# Altium schematic sheet 28Pins_Schematic.SchDoc (part 2 of 3)
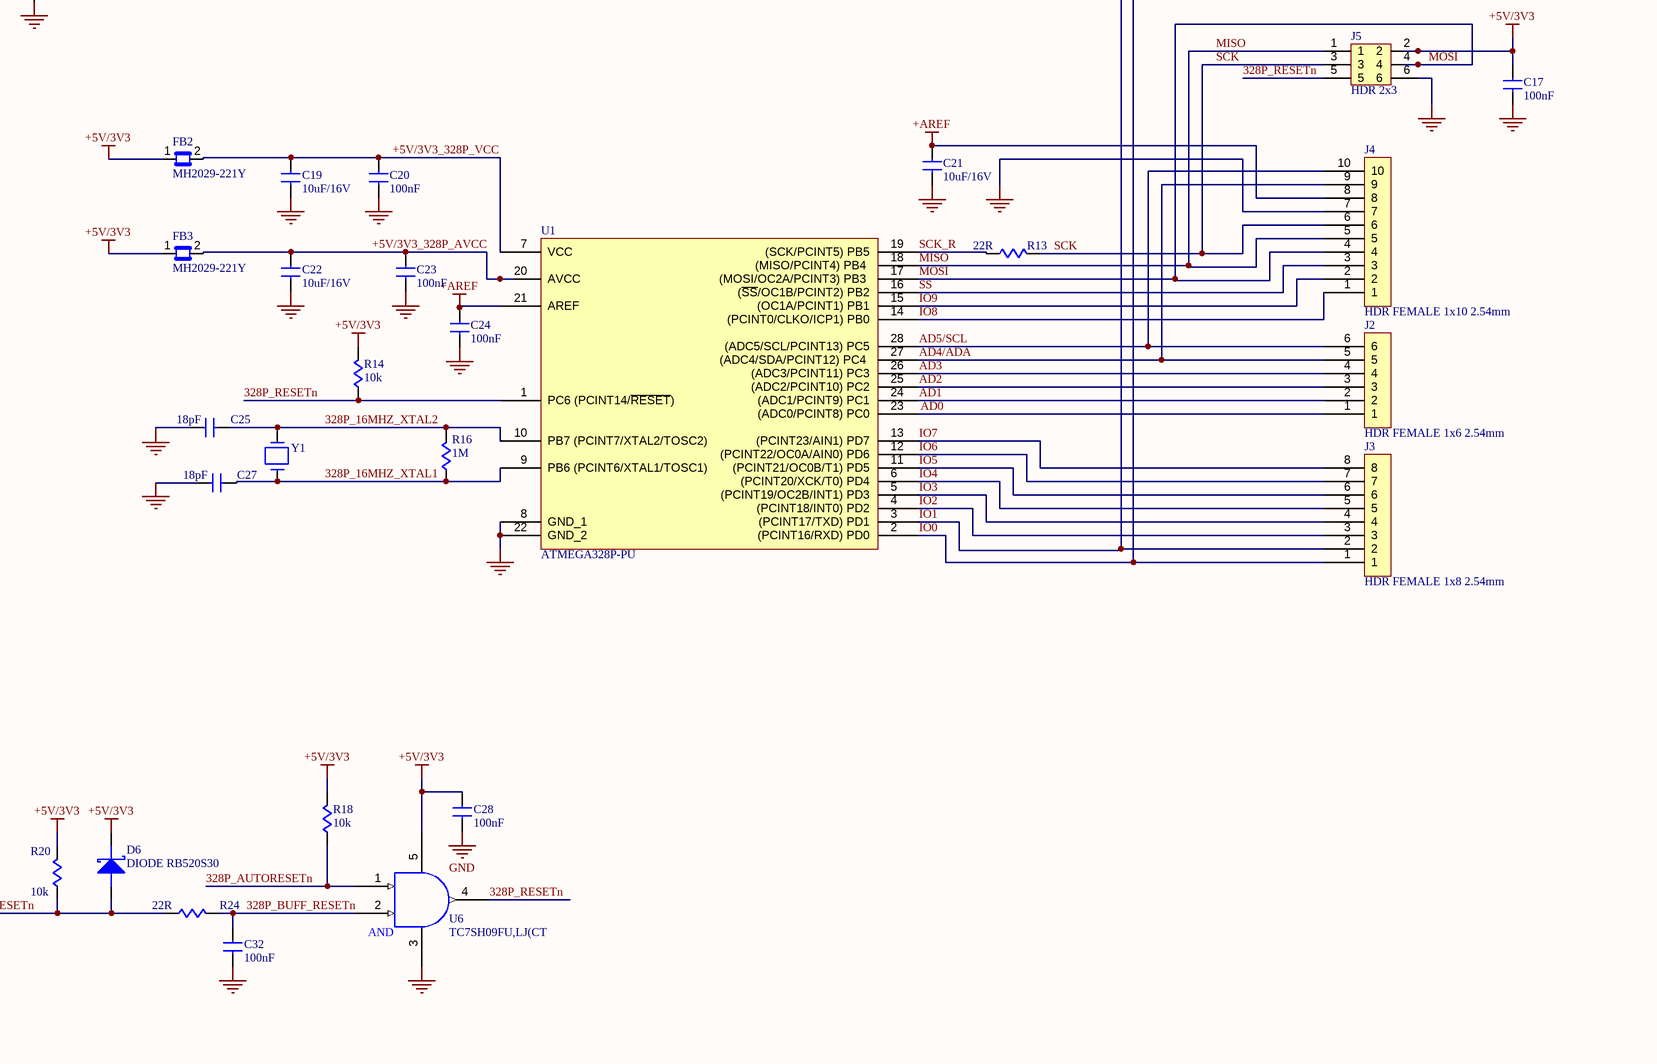
[diagram p4: 28Pins_Schematic.SchDoc, bottom right]
## Library data of the parts
C1 C2 = EEE-1AA101WAR: CAP ALUM 100UF 20% 10V SMD; Manufacturer: Panasonic; Ripple Current: 50mA; Polarity: Polar; Life (Hours): 1000Hour; Leakage Current: 3uA; Dissipation Factor: 0.3%; Supplier 1: Digi-Key; Supplier Part Number 1: PCE4566CT-ND; Manufacturer Part Number: EEE-1AA101WAR; RoHS: Yes; Category: Aluminum Electrolytic Capacitors; Stock 1: 1732; Pricing 1: 1=0.40000, 10=0.27900, 50=0.19520, 100=0.16730, 500=0.12550 (USD); Mount: Surface Mount,PCB; Case/Package: Radial; Min Operating Temperature: -40°C; Max Operating Temperature: 85°C; Capacitance: 100uF; Tolerance: 20%; Voltage Rating: 10V; Packaging: Tape and Reel; Package Quantity: 1000; Voltage Rating (DC): 10V; Ripple Current (AC): 50mA; Termination: SMD/SMT; Voltage: 10V; Series: Automotive, AEC-Q200, S; Construction: Cylindrical; Diameter: 5mm; Length: 5.5mm; Height: 5.4mm; Height - Seated (Max): 0.213inch; Lead Pitch: 1.5mm; Radiation Hardening: No; REACH SVHC: No SVHC; RoHS Compliant: Yes; ComponentLink1URL: https://datasheet.ciiva.com/2985/aba0000ce115-2985041.pdf?src-supplier=Avnet; ComponentLink1Description: https://datasheet.ciiva.com/2985/aba0000ce115-2985041.pdf?src-supplier=Avnet; ComponentLink2URL: https://datasheet.ciiva.com/43470/1790637-43470622.pdf?src-supplier=Farnell; ComponentLink2Description: https://datasheet.ciiva.com/43470/1790637-43470622.pdf?src-supplier=Farnell; ComponentLink3URL: https://datasheet.ciiva.com/31414/1790637-31414630.pdf?src-supplier=Farnell; ComponentLink3Description: https://datasheet.ciiva.com/31414/1790637-31414630.pdf?src-supplier=Farnell; ComponentLink4URL: https://datasheet.ciiva.com/46374/1790637-46374348.pdf?src-supplier=Element14; ComponentLink4Description: https://datasheet.ciiva.com/46374/1790637-46374348.pdf?src-supplier=Element14; ComponentLink5URL: https://datasheet.ciiva.com/46378/1790637-46378265.pdf?src-supplier=Element14; ComponentLink5Description: https://datasheet.ciiva.com/46378/1790637-46378265.pdf?src-supplier=Element14; ComponentLink6URL: https://datasheet.ciiva.com/14604/70255709-14604430.pdf?src-supplier=Allied+Electronics; ComponentLink6Description: https://datasheet.ciiva.com/14604/70255709-14604430.pdf?src-supplier=Allied+Electronics
C3 C12 C13 C19 C21 C22 C34 = GRM21BR61C106KE15L: CAP CER 10UF 16V X5R 0805; Manufacturer: Murata; Material: Ceramic; Tolerance: 10%; Supplier 1: Digi-Key; Supplier Part Number 1: 490-3886-1-ND; Manufacturer Part Number: GRM21BR61C106KE15L; RoHS: Yes; Category: Ceramic Capacitors; Pricing 1: 1=0.19000, 10=0.12900, 50=0.07760, 100=0.06560, 500=0.04484, 1000=0.03968 (USD); Mount: Surface Mount; Case/Package: 0805; Case Code (Imperial): 0805; Case Code (Metric): 2012; Min Operating Temperature: -55°C; Max Operating Temperature: 85°C; Packaging: Tape and Reel; Capacitance: 10uF; Voltage Rating: 16V; Voltage Rating (DC): 16V; Package Quantity: 1; Dielectric: X5R; Termination: SMD/SMT; Voltage: 16V; Series: GRM; Construction: Flat; Length: 2mm; Width: 1.25mm; Height: 1.25mm; Depth: 1.25mm; Thickness: 0.053inch; Radiation Hardening: No; REACH SVHC: No SVHC; RoHS Compliant: Yes; Lead Free: Lead Free; ComponentLink1URL: https://datasheet.ciiva.com/2989/product-2989696.pdf?src-supplier=Avnet; ComponentLink1Description: https://datasheet.ciiva.com/2989/product-2989696.pdf?src-supplier=Avnet; ComponentLink2URL: https://datasheet.ciiva.com/3777/1956grm21br61c106ke1523-3777137.pdf?src-supplier=Arrow+Electronics; ComponentLink2Description: https://datasheet.ciiva.com/3777/1956grm21br61c106ke1523-3777137.pdf?src-supplier=Arrow+Electronics; ComponentLink3URL: https://datasheet.ciiva.com/7719/1747468-7719090.pdf?src-supplier=Element14; ComponentLink3Description: https://datasheet.ciiva.com/7719/1747468-7719090.pdf?src-supplier=Element14; ComponentLink4URL: https://datasheet.ciiva.com/23628/460993-23628598.pdf?src-supplier=Newark; ComponentLink4Description: https://datasheet.ciiva.com/23628/460993-23628598.pdf?src-supplier=Newark; ComponentLink5URL: https://datasheet.ciiva.com/29199/454607-da-01-en-vs-kondensator-0805-29199611.pdf?src-supplier=Conrad; ComponentLink5Description: https://datasheet.ciiva.com/29199/454607-da-01-en-vs-kondensator-0805-29199611.pdf?src-supplier=Conrad; ComponentLink6URL: https://datasheet.ciiva.com/29202/450891-da-01-de-vs-chip-kond-0805-10-0-uf-10pr-16-0v-x5r-29202696.pdf?src-supplier=Conrad; ComponentLink6Description: https://datasheet.ciiva.com/29202/450891-da-01-de-vs-chip-kond-0805-10-0-uf-10pr-16-0v-x5r-29202696.pdf?src-supplier=Conrad; ComponentLink7URL: https://datasheet.ciiva.com/137/partnumbering-e-01-137917.pdf?src-supplier=Digi-Key; ComponentLink7Description: https://datasheet.ciiva.com/137/partnumbering-e-01-137917.pdf?src-supplier=Digi-Key; ComponentLink8URL: https://datasheet.ciiva.com/137/partnumbering-e-01-137918.pdf?src-supplier=Digi-Key; ComponentLink8Description: https://datasheet.ciiva.com/137/partnumbering-e-01-137918.pdf?src-supplier=Digi-Key; ComponentLink9URL: https://datasheet.ciiva.com/137/partnumbering-e-01-137919.pdf?src-supplier=Digi-Key; ComponentLink9Description: https://datasheet.ciiva.com/137/partnumbering-e-01-137919.pdf?src-supplier=Digi-Key; ComponentLink10URL: https://datasheet.ciiva.com/2989/product-2989697.pdf?src-supplier=Avnet; ComponentLink10Description: https://datasheet.ciiva.com/2989/product-2989697.pdf?src-supplier=Avnet
C4-C6 C8 C11 C14-C17 C20 C23 C24 C26 C28-C33 = 08055C104K4T4A: CAPACITOR CERAMIC, 0.1UF, 50V, X7R, 10%, 0805; Capacitance:0.1µF; Capacitance Tolerance:± 10%; Capacitor Case Style:0805 [2012 Metric]; Capacitor Dielectric Type:Ceramic; Capacitor Mounting:SMD; Capacitor Terminals:SMD; No. of Pins:2;RoHS Compliant: Yes; Manufacturer: Kyocera AVX; Supplier 1: Digi-Key; Supplier Part Number 1: 478-10546-1-ND; Manufacturer Part Number: 08055C104K4T4A; RoHS: Yes; Category: Ceramic Capacitors; Stock 1: 21932; Pricing 1: 1=0.17000, 10=0.12300, 50=0.06980, 100=0.05790, 500=0.04060, 1000=0.03361, 2500=0.03128, 5000=0.02862 (USD); Mount: Surface Mount; Case/Package: 0805; Number of Pins: 2; Case Code (Imperial): 0805; Case Code (Metric): 2012; Dielectric Material: Ceramic; Min Operating Temperature: -55°C; Max Operating Temperature: 125°C; Capacitance: 100nF; Packaging: Tape and Reel; Tolerance: 10%; Package Quantity: 20000; Voltage Rating: 50V; Voltage Rating (DC): 50V; Dielectric: X7R; Termination: SMD/SMT; Construction: Flat; Length: 2.01mm; Width: 1.25mm; Height: 0.94mm; Thickness: 0.037inch; Depth: 1.25mm; Ratings: AEC-Q200; Radiation Hardening: No; Lead Free: Lead Free; RoHS Compliant: Yes; ComponentLink1URL: https://datasheet.ciiva.com/26904/getdatasheetpartid-74229-26904224.pdf?src-supplier=Verical; ComponentLink1Description: https://datasheet.ciiva.com/26904/getdatasheetpartid-74229-26904224.pdf?src-supplier=Verical; ComponentLink2URL: https://datasheet.ciiva.com/207/cauto-207368.pdf?src-supplier=Digi-Key; ComponentLink2Description: https://datasheet.ciiva.com/207/cauto-207368.pdf?src-supplier=Digi-Key; ComponentLink3URL: https://datasheet.ciiva.com/5415/cauto-5415815.pdf?src-supplier=Mouser; ComponentLink3Description: https://datasheet.ciiva.com/5415/cauto-5415815.pdf?src-supplier=Mouser; ComponentLink4URL: https://datasheet.ciiva.com/16326/cauto-16326439.pdf?src-supplier=Future+Electronics; ComponentLink4Description: https://datasheet.ciiva.com/16326/cauto-16326439.pdf?src-supplier=Future+Electronics; ComponentLink5URL: https://datasheet.ciiva.com/16623/cauto-16623483.pdf?src-supplier=Avnet+Europe; ComponentLink5Description: https://datasheet.ciiva.com/16623/cauto-16623483.pdf?src-supplier=Avnet+Europe
C7 = C2012X5R1E105K125AA: TDK - C2012X5R1E105K125AA - SMD Multilayer Ceramic Capacitor, 1 µF, 25 V, 0805 [2012 Metric], ± 10%, X5R, C Series; Capacitance: 1uF; Voltage Rating: 25V; Supplier 1: Digi-Key; Supplier Part Number 1: 445-1419-1-ND; Manufacturer: TDK; Manufacturer Part Number: C2012X5R1E105K125AA; RoHS: Yes; Category: Ceramic Capacitors; Stock 1: 55; Pricing 1: 1=0.24000, 10=0.16600, 50=0.09940, 100=0.08390, 500=0.05740, 1000=0.05078 (USD); Mount: Surface Mount; Case/Package: 0805; Number of Pins: 2; Case Code (Metric): 2012; Case Code (Imperial): 0805; Dielectric Material: Ceramic; Weight: 0.000194oz; Min Operating Temperature: -55°C; Max Operating Temperature: 85°C; Tolerance: 10%; Packaging: Tape and Reel; Voltage Rating (DC): 25V; Dielectric: X5R; Termination: SMD/SMT; Construction: Flat; Package Quantity: 2000; Resistor Type: Ceramic; Voltage: 25V; Series: C; Length: 2mm; Width: 0.049inch; Height: 1.25mm; Depth: 1.25mm; Thickness: 0.057inch; Radiation Hardening: No; Lead Free: Lead Free; RoHS Compliant: Yes; REACH SVHC: No SVHC; ComponentLink1URL: https://datasheet.ciiva.com/11787/0900766b80c1bb00-11787608.pdf?src-supplier=RSComponents; ComponentLink1Description: https://datasheet.ciiva.com/11787/0900766b80c1bb00-11787608.pdf?src-supplier=RSComponents; ComponentLink2URL: https://datasheet.ciiva.com/28602/1744655-28602171.pdf?src-supplier=Element14; ComponentLink2Description: https://datasheet.ciiva.com/28602/1744655-28602171.pdf?src-supplier=Element14; ComponentLink3URL: https://datasheet.ciiva.com/15192/getdatasheetpartid-726707-15192140.pdf?src-supplier=Verical; ComponentLink3Description: https://datasheet.ciiva.com/15192/getdatasheetpartid-726707-15192140.pdf?src-supplier=Verical; ComponentLink4URL: https://datasheet.ciiva.com/16449/e412-c-16449595.pdf?src-supplier=Future+Electronics; ComponentLink4Description: https://datasheet.ciiva.com/16449/e412-c-16449595.pdf?src-supplier=Future+Electronics
C9 C10 C25 C27 = GJM1551C1HR56BB01D: CAP CER 18pF; Manufacturer: Murata; Supplier 1: Digi-Key; Supplier Part Number 1: 399-C0805C180J5HAC7800CT-ND; Manufacturer Part Number: GJM1551C1HR56BB01D; RoHS: Yes; Stock 1: 10868; Pricing 1: 1=0.11000, 10=0.08300, 50=0.04560, 100=0.03720, 500=0.02656, 1000=0.02087 (USD)
D1 = LGL29K-F2J1-24-Z: LED Uni-Color Green 572nm Automotive 2-Pin Chip 0603(1608Metric) T/R; Manufacturer: Osram Opto; Lens Color: White; Forward Current: 20mA; Forward Voltage: 1.7V; Luminous Intensity: 3.5mcd; Viewing Angle: 160°; Lens Style: Flat,Diffused,Colorless,Rectangular; Lens Transparency: Diffused; Test Current: 2mA; Dominant Wavelength: 570nm; Luminous Flux: 0.015lm; Number of LEDs: 1; Lens Size: 0.8mm; Supplier 1: Digi-Key; Supplier Part Number 1: 475-3118-1-ND; Manufacturer Part Number: LGL29K-F2J1-24-Z; RoHS: Yes; Category: Uncategorized; Stock 1: 45756; Mount: Surface Mount; Case/Package: 0603; Number of Pins: 2; Color: Green; Case Code (Metric): 1608; Case Code (Imperial): 0603; Min Operating Temperature: -40°C; Max Operating Temperature: 100°C; Illumination Color: Green; Packaging: Tape and Reel; Package Quantity: 5000; Series: SMARTLED® 0603; Length: 1.7mm; Width: 0.8mm; Height: 0.65mm; Radiation Hardening: No; RoHS Compliant: Yes; ComponentLink1URL: http://components.arrow.com/part/dataview/41971649S9781339N2128?src-supplier=Arrow+Electronics; ComponentLink1Description: http://components.arrow.com/part/dataview/41971649S9781339N2128?src-supplier=Arrow+Electronics; ComponentLink2URL: http://components.arrow.com/part/dataview/0323_02006818?src-supplier=Arrow+Europe; ComponentLink2Description: http://components.arrow.com/part/dataview/0323_02006818?src-supplier=Arrow+Europe; ComponentLink3URL: https://dammedia.osram.info/media/resource/hires/osram-dam-2493945/LG%20L29K.pdf?src-supplier=Digi-Key; ComponentLink3Description: https://dammedia.osram.info/media/resource/hires/osram-dam-2493945/LG%20L29K.pdf?src-supplier=Digi-Key; ComponentLink4URL: http://catalog.osram-os.com/catalogue/catalogue.do;jsessionid=3DE84243E85F820603DAFD5199D8DDA3?act=downloadFile&favOid=020000020000138e000100b6&src-supplier=Avnet; ComponentLink4Description: http://catalog.osram-os.com/catalogue/catalogue.do;jsessionid=3DE84243E85F820603DAFD5199D8DDA3?act=downloadFile&favOid=020000020000138e000100b6&src-supplier=Avnet; ComponentLink5URL: http://catalog.osram-os.com/catalogue/catalogue.do;jsessionid=3DE84243E85F820603DAFD5199D8DDA3?act=downloadFile&favOid=020000020000138e000100b6&src-supplier=Avnet+Europe; ComponentLink5Description: http://catalog.osram-os.com/catalogue/catalogue.do;jsessionid=3DE84243E85F820603DAFD5199D8DDA3?act=downloadFile&favOid=020000020000138e000100b6&src-supplier=Avnet+Europe
D2-D4 = LOL29K-H2K1-24-Z: OSRAM - LO L29K-H2K1-24-Z - SMARTLED 0603 ORANGE 55AC2374; Manufacturer: Osram Opto; Lens Color: White; Forward Current: 20mA; Forward Voltage: 2.2V; Luminous Intensity: 9mcd; Viewing Angle: 160°; Lens Style: Flat,Diffused,Colorless,Rectangular; Test Current: 2mA; Dominant Wavelength: 606nm; Luminous Flux: 0.025lm; Number of LEDs: 1; Reverse Voltage: 12V; Lens Transparency: Diffused; Lens Size: 0.8mm; Supplier 1: Digi-Key; Supplier Part Number 1: 475-2740-1-ND; Manufacturer Part Number: LOL29K-H2K1-24-Z; RoHS: Yes; Category: Uncategorized; Stock 1: 35248; Pricing 1: 1=0.460000, 10=0.300000, 100=0.200100, 500=0.138400, 1000=0.115330, 2000=0.103800 (USD); Mount: Surface Mount; Case/Package: 0603; Number of Pins: 2; Color: Orange; Case Code (Metric): 1608; Case Code (Imperial): 0603; Min Operating Temperature: -40°C; Max Operating Temperature: 100°C; Packaging: Tape and Reel; Number of Elements: 1; Series: SmartLED; Illumination Color: Orange; Package Quantity: 5000; Length: 1.3mm; Width: 0.8mm; Height: 0.65mm; Depth: 0.8mm; Radiation Hardening: No; RoHS Compliant: Yes; ComponentLink1URL: https://datasheet.ciiva.com/2112/00077105-0-2112905.pdf?src-supplier=Digi-Key; ComponentLink1Description: https://datasheet.ciiva.com/2112/00077105-0-2112905.pdf?src-supplier=Digi-Key; ComponentLink2URL: https://datasheet.ciiva.com/2112/00077105-0-2112904.pdf?src-supplier=Digi-Key; ComponentLink2Description: https://datasheet.ciiva.com/2112/00077105-0-2112904.pdf?src-supplier=Digi-Key; ComponentLink3URL: https://datasheet.ciiva.com/2112/00077105-0-2112906.pdf?src-supplier=Digi-Key; ComponentLink3Description: https://datasheet.ciiva.com/2112/00077105-0-2112906.pdf?src-supplier=Digi-Key; ComponentLink4URL: https://datasheet.ciiva.com/15198/getdatasheetpartid-693885-15198412.pdf?src-supplier=Verical; ComponentLink4Description: https://datasheet.ciiva.com/15198/getdatasheetpartid-693885-15198412.pdf?src-supplier=Verical
D5 D6 = RB520S30: DIODE, SCHOTTKY, 200mA, 30V, SOD-523F FAIRCHILD SEMICONDUCTOR RB520S30; Manufacturer: ON Semiconductor / Fairchild; Forward Voltage: 600mV; Max Reverse Leakage Current: 1uA; Max Forward Surge Current (Ifsm): 1A; Power Dissipation: 200mW; Element Configuration: Single; Supplier 1: Digi-Key; Supplier Part Number 1: 1990-RB520S30CT-ND; Manufacturer Part Number: RB520S30; RoHS: Yes; Category: Schottky Diodes; Stock 1: 1265; Pricing 1: 1=0.25000, 10=0.20700, 100=0.10970, 500=0.07218, 1000=0.04909 (USD); Mount: Surface Mount; Number of Pins: 2; Weight: 0.01g; Min Operating Temperature: -55°C; Max Operating Temperature: 125°C; Packaging: Tape and Reel; Average Rectified Current: 200mA; Max Reverse Voltage (DC): 30V; Forward Current: 200mA; Package Quantity: 8000; Max Repetitive Reverse Voltage (Vrrm): 30V; Max Reverse Current: 1uA; Series: -; Length: 1.3mm; Width: 0.9mm; Height: 0.7mm; Radiation Hardening: No; REACH SVHC: No SVHC; Lead Free: Lead Free; RoHS Compliant: Yes; ComponentLink1URL: https://datasheet.ciiva.com/4714/rb520s30-310176-4714317.pdf?src-supplier=Mouser; ComponentLink1Description: https://datasheet.ciiva.com/4714/rb520s30-310176-4714317.pdf?src-supplier=Mouser; ComponentLink2URL: https://datasheet.ciiva.com/22651/1706530-22651969.pdf?src-supplier=Element14; ComponentLink2Description: https://datasheet.ciiva.com/22651/1706530-22651969.pdf?src-supplier=Element14; ComponentLink3URL: https://datasheet.ciiva.com/916/rb520s30-916875.pdf?src-supplier=Digi-Key; ComponentLink3Description: https://datasheet.ciiva.com/916/rb520s30-916875.pdf?src-supplier=Digi-Key; ComponentLink4URL: https://datasheet.ciiva.com/8300/rb520s30-8300837.pdf?src-supplier=Avnet; ComponentLink4Description: https://datasheet.ciiva.com/8300/rb520s30-8300837.pdf?src-supplier=Avnet
FB1-FB3 = MH2029-221Y: BEAD FERRITE 220 OHM 2.0A 0805; Manufacturer: Bourns; Tolerance: 25%; Impedance: 220R; Current Rating: 3A; Number of Lines: 1; Max Current Rating: 2A; DC Resistance (DCR): 40mR; Test Frequency: 100MHz; Supplier 1: Digi-Key; Supplier Part Number 1: MH2029-221YCT-ND; Manufacturer Part Number: MH2029-221Y; RoHS: Yes; Category: Ferrite Beads and Chips; Stock 1: 107514; Pricing 1: 1=0.10000, 10=0.07300, 25=0.06600, 50=0.05940, 100=0.04360, 250=0.03168, 500=0.02904, 1000=0.02508 (USD); Mount: Surface Mount; Case/Package: 0805; Core Material: Ferrite; Case Code (Metric): 2012; Case Code (Imperial): 0805; Contact Plating: Tin; Min Operating Temperature: -55°C; Max Operating Temperature: 125°C; Packaging: Tape and Reel; Package Quantity: 1; Max DC Current: 2A; Termination: SMD/SMT; Series: MH; Length: 0.079inch; Width: 0.047inch; Height: 0.043inch; Depth: 1.4mm; REACH SVHC: No SVHC; RoHS Compliant: Yes; ComponentLink1URL: https://datasheet.ciiva.com/4940/mh-69602-4940601.pdf?src-supplier=Mouser; ComponentLink1Description: https://datasheet.ciiva.com/4940/mh-69602-4940601.pdf?src-supplier=Mouser
FID1-FID4 = FID_1MMC
J1 J3 = M20-7820842: CONN HEADER 8POS 0.1" PITCH; Manufacturer: Harwin; Number of Contacts: 8; Max Current Rating: 3A; Contact Resistance: 20mR; Connector Type: Receptacle; Supplier 1: Digi-Key; Supplier Part Number 1: 952-1823-ND; Manufacturer Part Number: M20-7820842; RoHS: Yes; Category: Headers and Wire Housings; Stock 1: 1049; Pricing 1: 1=1.18000, 10=1.04100, 100=0.89770, 500=0.73448, 1000=0.65286, 5000=0.57126, 10000=0.54269 (USD); Mount: Through Hole; Case/Package: SIL; Contact Plating: Tin,Gold; Color: Black; Contact Material: Bronze; Weight: 0.025397oz; Housing Color: Black; Housing Material: Polyamide; Min Operating Temperature: -40°C; Max Operating Temperature: 105°C; Number of Rows: 1; Termination: Solder; Contact Gender: Female; Package Quantity: 29; Packaging: Rail/Tube; Number of Positions: 8; Orientation: Straight; Gender: Female; Series: M20; Contact Type: Female Socket; Length: 20.72mm; Pitch: 2.54mm; Depth: 2.5mm; Radiation Hardening: No; RoHS Compliant: Yes; ComponentLink1URL: https://datasheet.ciiva.com/9480/m20-782-9480074.pdf?src-supplier=Avnet; ComponentLink1Description: https://datasheet.ciiva.com/9480/m20-782-9480074.pdf?src-supplier=Avnet; ComponentLink2URL: https://datasheet.ciiva.com/16732/m20-782-16732663.pdf?src-supplier=Avnet+Europe; ComponentLink2Description: https://datasheet.ciiva.com/16732/m20-782-16732663.pdf?src-supplier=Avnet+Europe
J2 = M20-7820646: CONN HEADER 6POS 0.1" PITCH; Manufacturer: Harwin; Number of Contacts: 6; Max Current Rating: 3A; Contact Resistance: 20mR; Connector Type: Receptacle; Supplier 1: Digi-Key; Supplier Part Number 1: 952-1809-ND; Manufacturer Part Number: M20-7820646; RoHS: Yes; Category: Headers and Wire Housings; Stock 1: 1266; Pricing 1: 1=1.02000, 10=0.89900, 100=0.77550, 500=0.63448, 1000=0.56398, 5000=0.49349, 10000=0.46881 (USD); Mount: Through Hole; Case/Package: SIL; Color: Black; Contact Plating: Tin; Contact Material: Bronze; Housing Color: Black; Housing Material: Nylon; Min Operating Temperature: -40°C; Max Operating Temperature: 105°C; Number of Rows: 1; Termination: Solder; Packaging: Rail/Tube; Contact Gender: Female; Package Quantity: 38; Number of Positions: 6; Orientation: Straight; Gender: Female; Series: M20; Contact Type: Female Socket; Length: 15.64mm; Pitch: 2.54mm; Depth: 2.5mm; Radiation Hardening: No; RoHS Compliant: Yes; ComponentLink1URL: http://components.arrow.com/part/dataview/0323_00725884?src-supplier=Arrow+Europe; ComponentLink1Description: http://components.arrow.com/part/dataview/0323_00725884?src-supplier=Arrow+Europe; ComponentLink2URL: https://cdn.harwin.com/pdfs/M20-782.pdf?src-supplier=Farnell; ComponentLink2Description: https://cdn.harwin.com/pdfs/M20-782.pdf?src-supplier=Farnell; ComponentLink3URL: http://www.harwin.com/include/downloads/pdfs/2010PAGE120.PDF?src-supplier=Avnet; ComponentLink3Description: http://www.harwin.com/include/downloads/pdfs/2010PAGE120.PDF?src-supplier=Avnet; ComponentLink4URL: https://cdn.harwin.com/pdfs/M20-782.pdf?src-supplier=Digi-Key; ComponentLink4Description: https://cdn.harwin.com/pdfs/M20-782.pdf?src-supplier=Digi-Key; ComponentLink5URL: https://cdn.harwin.com/pdfs/Harwin_PC_Connectors_M20.pdf?src-supplier=Mouser; ComponentLink5Description: https://cdn.harwin.com/pdfs/Harwin_PC_Connectors_M20.pdf?src-supplier=Mouser; ComponentLink6URL: https://cdn.harwin.com/pdfs/Harwin_PC_Connectors_M20.pdf?src-supplier=Avnet+Europe; ComponentLink6Description: https://cdn.harwin.com/pdfs/Harwin_PC_Connectors_M20.pdf?src-supplier=Avnet+Europe; ComponentLink7URL: https://cdn.harwin.com/pdfs/Harwin_PC_Connectors_M20.pdf?src-supplier=RSComponents; ComponentLink7Description: https://cdn.harwin.com/pdfs/Harwin_PC_Connectors_M20.pdf?src-supplier=RSComponents; ComponentLink8URL: https://cdn.harwin.com/pdfs/M20-782.pdf?src-supplier=Newark; ComponentLink8Description: https://cdn.harwin.com/pdfs/M20-782.pdf?src-supplier=Newark; ComponentLink9URL: https://cdn.harwin.com/pdfs/Harwin_PC_Connectors_M20.pdf?src-supplier=TTI; ComponentLink9Description: https://cdn.harwin.com/pdfs/Harwin_PC_Connectors_M20.pdf?src-supplier=TTI
J4 = M20-7821046: CONN HEADER 10POS 0.1" PITCH HARWIN - M20-7821046; Number of Contacts: 10; Max Current Rating: 3A; Contact Resistance: 20mR; Mating Cycles: 50; Connector Type: Receptacle; Insulation Resistance: 1MR; Hole Diameter: 0.8mm; Supplier 1: Digi-Key; Supplier Part Number 1: 952-1847-ND; Manufacturer: Harwin; Manufacturer Part Number: M20-7821046; RoHS: Yes; Category: Headers and Wire Housings; Stock 1: 639; Pricing 1: 1=1.29000, 10=1.13300, 100=0.97770, 500=0.79992, 1000=0.71104, 5000=0.62216, 10000=0.59105 (USD); Mount: Through Hole; Case/Package: SIL; Color: Black; Contact Plating: Tin; Contact Material: Bronze; Housing Color: Black; Housing Material: Polyamide; Min Operating Temperature: -40°C; Max Operating Temperature: 105°C; Number of Rows: 1; Termination: Solder; Packaging: Rail/Tube; Contact Gender: Female; Package Quantity: 23; Current Rating: 3A; Number of Positions: 10; Gender: Receptacle; Orientation: Straight; Series: M20; Contact Type: Female Socket; Length: 25.8mm; Pitch: 2.54mm; Lead Pitch: 2.54mm; Depth: 2.5mm; Radiation Hardening: No; REACH SVHC: No SVHC; ComponentLink1URL: https://datasheet.ciiva.com/11753/0900766b80dc1d2b-11753869.pdf?src-supplier=RSComponents; ComponentLink1Description: https://datasheet.ciiva.com/11753/0900766b80dc1d2b-11753869.pdf?src-supplier=RSComponents; ComponentLink2URL: https://datasheet.ciiva.com/26899/getdatasheetpartid-559226-26899379.pdf?src-supplier=Verical; ComponentLink2Description: https://datasheet.ciiva.com/26899/getdatasheetpartid-559226-26899379.pdf?src-supplier=Verical; ComponentLink3URL: https://datasheet.ciiva.com/10151/m20-782-10151366.pdf?src-supplier=Avnet; ComponentLink3Description: https://datasheet.ciiva.com/10151/m20-782-10151366.pdf?src-supplier=Avnet; ComponentLink4URL: https://datasheet.ciiva.com/6785/m20-782-6785605.pdf?src-supplier=Digi-Key; ComponentLink4Description: https://datasheet.ciiva.com/6785/m20-782-6785605.pdf?src-supplier=Digi-Key; ComponentLink5URL: https://datasheet.ciiva.com/16732/m20-782-16732152.pdf?src-supplier=Avnet+Europe; ComponentLink5Description: https://datasheet.ciiva.com/16732/m20-782-16732152.pdf?src-supplier=Avnet+Europe
J5 J6 = 68602-206HLF: AMPHENOL FCI   68602-206HLF   BOARD TO BOARD, HEADER, 6 POSITION, 2ROW; Manufacturer: Amphenol ICC / FCI; Number of Contacts: 6; Current Rating: 3A; Voltage Rating: 1.5kV; Insulation Resistance: 5GR; Gender: Male; Connector Type: Male Pin; Pitch: 2.54mm; Contact Post Length: 3.81mm; Row Spacing: 0.1inch; Supplier 1: Digi-Key; Supplier Part Number 1: 609-3370-ND; Manufacturer Part Number: 68602-206HLF; RoHS: Yes; Category: Headers and Wire Housings; Stock 1: 3266; Pricing 1: 1=0.50000, 10=0.46800, 100=0.35890, 500=0.31208, 1000=0.25747, 5000=0.22627, 10000=0.21066 (USD); Mount: Through Hole; Contact Plating: Gold,GXT; Contact Material: Bronze; Color: Black; Housing Color: Black; Housing Material: Thermoplastic; Min Operating Temperature: -65°C; Max Operating Temperature: 125°C; Number of Rows: 2; Termination: Solder; Contact Gender: Male; Package Quantity: 100; Packaging: Bulk; Number of Positions: 6; Max Voltage Rating (AC): 1.5kV; Orientation: Straight; Series: BERGSTIK® II, MezzSelect™, Basics+; Contact Type: Male Pin; Length: 7.62mm; Contact Mating Length: 0.23inch; Depth: 4.83mm; Radiation Hardening: No; REACH SVHC: No SVHC; Flammability Rating: UL94 V-0; ComponentLink1URL: https://datasheet.ciiva.com/46393/1876884-46393069.pdf?src-supplier=Element14; ComponentLink1Description: https://datasheet.ciiva.com/46393/1876884-46393069.pdf?src-supplier=Element14; ComponentLink2URL: https://datasheet.ciiva.com/728/67996-728909.pdf?src-supplier=Digi-Key; ComponentLink2Description: https://datasheet.ciiva.com/728/67996-728909.pdf?src-supplier=Digi-Key; ComponentLink3URL: https://datasheet.ciiva.com/9465/67996-9465932.pdf?src-supplier=Avnet; ComponentLink3Description: https://datasheet.ciiva.com/9465/67996-9465932.pdf?src-supplier=Avnet
J7 = 10118192-0001LF: CONN USB MICRO B RECPT SMT R/A; Manufacturer: Amphenol ICC / FCI; Supplier 1: Digi-Key; Supplier Part Number 1: 609-4613-1-ND; Manufacturer Part Number: 10118192-0001LF; RoHS: No; Stock 1: 92561; Pricing 1: 1=0.44000, 10=0.41000, 25=0.36920, 50=0.32820, 100=0.31450, 250=0.28720, 500=0.27350 (USD); ComponentLink1URL: http://components.arrow.com/part/dataview/0323_04107371?src-supplier=Arrow+Europe; ComponentLink1Description: http://components.arrow.com/part/dataview/0323_04107371?src-supplier=Arrow+Europe; ComponentLink2URL: http://uk.rs-online.com/webdocs/1450/0900766b814507ee.pdf?src-supplier=RSComponents; ComponentLink2Description: http://uk.rs-online.com/webdocs/1450/0900766b814507ee.pdf?src-supplier=RSComponents; ComponentLink3URL: https://cdn.amphenol-icc.com/media/wysiwyg/files/documentation/datasheet/inputoutput/io_usb_micro.pdf?src-supplier=Avnet; ComponentLink3Description: https://cdn.amphenol-icc.com/media/wysiwyg/files/documentation/datasheet/inputoutput/io_usb_micro.pdf?src-supplier=Avnet; ComponentLink4URL: https://cdn.amphenol-icc.com/media/wysiwyg/files/documentation/datasheet/inputoutput/io_usb_micro.pdf?src-supplier=Arrow+Electronics; ComponentLink4Description: https://cdn.amphenol-icc.com/media/wysiwyg/files/documentation/datasheet/inputoutput/io_usb_micro.pdf?src-supplier=Arrow+Electronics; ComponentLink5URL: https://cdn.amphenol-icc.com/media/wysiwyg/files/documentation/datasheet/inputoutput/io_usb_micro.pdf?src-supplier=Verical; ComponentLink5Description: https://cdn.amphenol-icc.com/media/wysiwyg/files/documentation/datasheet/inputoutput/io_usb_micro.pdf?src-supplier=Verical; ComponentLink6URL: http://portal.fciconnect.com/Comergent//fci/drawing/10118192.pdf?src-supplier=Avnet+Asia; ComponentLink6Description: http://portal.fciconnect.com/Comergent//fci/drawing/10118192.pdf?src-supplier=Avnet+Asia; ComponentLink7URL: https://cdn.amphenol-icc.com/media/wysiwyg/files/documentation/datasheet/inputoutput/io_usb_micro.pdf?src-supplier=Allied+Electronics; ComponentLink7Description: https://cdn.amphenol-icc.com/media/wysiwyg/files/documentation/datasheet/inputoutput/io_usb_micro.pdf?src-supplier=Allied+Electronics; ComponentLink8URL: http://www.farnell.com/datasheets/2366786.pdf?src-supplier=Newark; ComponentLink8Description: http://www.farnell.com/datasheets/2366786.pdf?src-supplier=Newark; ComponentLink9URL: https://cdn.amphenol-icc.com/media/wysiwyg/files/documentation/datasheet/inputoutput/io_usb_micro.pdf?src-supplier=Mouser; ComponentLink9Description: https://cdn.amphenol-icc.com/media/wysiwyg/files/documentation/datasheet/inputoutput/io_usb_micro.pdf?src-supplier=Mouser; ComponentLink10URL: http://www.amphenol-icc.com/media/wysiwyg/files/drawing/10118192.pdf?src-supplier=Digi-Key; ComponentLink10Description: http://www.amphenol-icc.com/media/wysiwyg/files/drawing/10118192.pdf?src-supplier=Digi-Key; ComponentLink11URL: http://www.farnell.com/cad/1935767.pdf?src-supplier=Element14; ComponentLink11Description: http://www.farnell.com/cad/1935767.pdf?src-supplier=Element14; ComponentLink12URL: http://www.farnell.com/datasheets/2366786.pdf?src-supplier=Farnell; ComponentLink12Description: http://www.farnell.com/datasheets/2366786.pdf?src-supplier=Farnell; ComponentLink13URL: https://cdn.amphenol-icc.com/media/wysiwyg/files/documentation/datasheet/inputoutput/io_usb_micro.pdf?src-supplier=TME; ComponentLink13Description: https://cdn.amphenol-icc.com/media/wysiwyg/files/documentation/datasheet/inputoutput/io_usb_micro.pdf?src-supplier=TME; ComponentLink14URL: https://cdn.amphenol-icc.com/media/wysiwyg/files/documentation/datasheet/inputoutput/io_usb_micro.pdf?src-supplier=TTI; ComponentLink14Description: https://cdn.amphenol-icc.com/media/wysiwyg/files/documentation/datasheet/inputoutput/io_usb_micro.pdf?src-supplier=TTI; ComponentLink15URL: https://cdn.amphenol-icc.com/media/wysiwyg/files/documentation/datasheet/inputoutput/io_usb_micro.pdf?src-supplier=NAC+Semi; ComponentLink15Description: https://cdn.amphenol-icc.com/media/wysiwyg/files/documentation/datasheet/inputoutput/io_usb_micro.pdf?src-supplier=NAC+Semi; ComponentLink16URL: https://cdn.amphenol-icc.com/media/wysiwyg/files/documentation/datasheet/inputoutput/io_usb_micro.pdf?src-supplier=SOS+electronic; ComponentLink16Description: https://cdn.amphenol-icc.com/media/wysiwyg/files/documentation/datasheet/inputoutput/io_usb_micro.pdf?src-supplier=SOS+electronic; ComponentLink17URL: https://cdn.amphenol-icc.com/media/wysiwyg/files/documentation/datasheet/inputoutput/io_usb_micro.pdf?src-supplier=Freelance+Electronics; ComponentLink17Description: https://cdn.amphenol-icc.com/media/wysiwyg/files/documentation/datasheet/inputoutput/io_usb_micro.pdf?src-supplier=Freelance+Electronics; ComponentLink18URL: https://cdn.amphenol-icc.com/media/wysiwyg/files/documentation/datasheet/inputoutput/io_usb_micro.pdf?src-supplier=Heilind+Electronics; ComponentLink18Description: https://cdn.amphenol-icc.com/media/wysiwyg/files/documentation/datasheet/inputoutput/io_usb_micro.pdf?src-supplier=Heilind+Electronics
J8 J9 = PAD_WITH_HOLE: Pad with a hole 4mm x 1.5mm
JP1 JP4 = 68000-103HLF: CONN HEADER 3POS 0.1" PITCH AMPHENOL ICC - 68000-103HLF, FCI BergStik II 68000 Series; Supplier 1: Digi-Key; Supplier Part Number 1: 609-3461-ND; Manufacturer: Amphenol ICC; Manufacturer Part Number: 68000-103HLF; RoHS: Yes; Category: Headers and Wire Housings; Stock 1: 52107; Pricing 1: 1=0.33000, 10=0.31000, 100=0.21700, 500=0.18602, 1000=0.15501, 5000=0.13287, 10000=0.12401 (USD); RoHS Compliant: Yes; ComponentLink1URL: http://www.farnell.com/cad/1914865.pdf?src-supplier=Farnell; ComponentLink1Description: http://www.farnell.com/cad/1914865.pdf?src-supplier=Farnell; ComponentLink2URL: http://www.farnell.com/cad/1914865.pdf?src-supplier=Element14; ComponentLink2Description: http://www.farnell.com/cad/1914865.pdf?src-supplier=Element14; ComponentLink3URL: http://www.farnell.com/cad/1914865.pdf?src-supplier=Newark; ComponentLink3Description: http://www.farnell.com/cad/1914865.pdf?src-supplier=Newark; ComponentLink4URL: https://cdn.amphenol-icc.com/media/wysiwyg/files/drawing/68000.pdf?src-supplier=Digi-Key; ComponentLink4Description: https://cdn.amphenol-icc.com/media/wysiwyg/files/drawing/68000.pdf?src-supplier=Digi-Key
JP2 = 77313-124-04LF: Manufacturer: AMPHENOL ICC (FCI); Supplier 1: Digi-Key; Supplier Part Number 1: 609-77313-124-04LF-ND; Manufacturer Part Number: 77313-124-04LF; RoHS: No; Stock 1: 986; Pricing 1: 1=0.33000, 10=0.31100, 100=0.21780, 500=0.18664, 1000=0.15554, 5000=0.13332, 10000=0.12443 (USD)
JP3 = 68001-204HLF: CONN HEADER 4 POS 2.54mm Solder ST Thru-Hole Bag; Manufacturer: ICC; Supplier 1: Digi-Key; Supplier Part Number 1: 609-3402-ND; Manufacturer Part Number: 68001-204HLF; RoHS: No; Category: Headers and Wire Housings; Stock 1: 1836; Pricing 1: 1=0.42000, 10=0.39800, 100=0.27890, 500=0.23904, 1000=0.19920, 5000=0.17074, 10000=0.15936 (USD)
L1 = L1210R2R2MDWIT: INDUCTOR  L1210R2R2MDWIT KEMET; Core Material: Ferrite; Tolerance: 20%; Inductance: 2.2uH; Shielding: Unshielded; Self Resonant Frequency: 190MHz; DC Resistance (DCR): 80mR; Test Frequency: 100kHz; DC Current: 1.13A; Supplier 1: Digi-Key; Supplier Part Number 1: 399-9598-1-ND; Manufacturer: KEMET; Manufacturer Part Number: L1210R2R2MDWIT; RoHS: Yes; Category: Fixed Inductors; Stock 1: 11603; Pricing 1: 1=0.50000, 10=0.43700, 25=0.40600, 50=0.34360, 100=0.31240, 250=0.29364, 500=0.26240 (USD); Mount: Surface Mount; Case/Package: 1210; Case Code (Metric): 3225; Case Code (Imperial): 1210; Min Operating Temperature: -40°C; Max Operating Temperature: 105°C; Max DC Current: 2A; Package Quantity: 1000; Current Rating: 2A; Packaging: Tape and Reel; Inductance Tolerance: 20%; Resistor Type: Wirewound,Ceramic; Termination: SMD/SMT; Series: L-DWI; Length: 0.126inch; Width: 0.098inch; Height: 2.5mm; Height - Seated (Max): 0.106inch; Depth: 2.7mm; Radiation Hardening: No; REACH SVHC: No SVHC; Military Standard: Not; RoHS Compliant: Yes; ComponentLink1URL: https://datasheet.ciiva.com/8512/f3115-8512543.pdf?src-supplier=Avnet; ComponentLink1Description: https://datasheet.ciiva.com/8512/f3115-8512543.pdf?src-supplier=Avnet; ComponentLink2URL: https://datasheet.ciiva.com/6691/f3115-6691487.pdf?src-supplier=Digi-Key; ComponentLink2Description: https://datasheet.ciiva.com/6691/f3115-6691487.pdf?src-supplier=Digi-Key; ComponentLink3URL: https://datasheet.ciiva.com/4957/f3115-4957838.pdf?src-supplier=Mouser; ComponentLink3Description: https://datasheet.ciiva.com/4957/f3115-4957838.pdf?src-supplier=Mouser; ComponentLink4URL: https://datasheet.ciiva.com/17280/f3115-17280270.pdf?src-supplier=Avnet+Europe; ComponentLink4Description: https://datasheet.ciiva.com/17280/f3115-17280270.pdf?src-supplier=Avnet+Europe; ComponentLink5URL: https://datasheet.ciiva.com/22685/27262-22685038.pdf?src-supplier=Element14; ComponentLink5Description: https://datasheet.ciiva.com/22685/27262-22685038.pdf?src-supplier=Element14
LINK1-LINK3 = QPC02SXGN-RC: CONN JUMPER SHORTING .100" GOLD; Manufacturer: Sullins; Number of Positions: 2; Pitch: 0.1inch; Supplier 1: Digi-Key; Supplier Part Number 1: S9337-ND; Manufacturer Part Number: QPC02SXGN-RC; RoHS: Yes; Category: Connectors; Stock 1: 471397; Pricing 1: 1=0.10000, 25=0.04400, 50=0.03780, 250=0.03152, 750=0.02835, 1000=0.02646, 12000=0.02016, 24000=0.01827, 48000=0.01820 (USD); Case/Package: 100; Contact Plating: Gold; Package Quantity: 2000; Packaging: Bulk; Height: 0.235inch; Lead Free: Lead Free; ComponentLink1URL: https://datasheet.ciiva.com/767/284-sxgn-11510-767869.pdf?src-supplier=Digi-Key; ComponentLink1Description: https://datasheet.ciiva.com/767/284-sxgn-11510-767869.pdf?src-supplier=Digi-Key
MH1-MH3 = MH_7.4MMC_3.2: Mounting hole 7.4mm diameter, 3.2mm drill
MH4 = MH_7.4MMNC_3.2MMD: Hole 7.4mm diamter (non copper) 3.2 mm dril NPTH
R1 = RC0805FR-07100KL: Res Thick Film 0805 100K Ohm 1% 1/8W ±100ppm/°C Molded SMD Paper T/R; Manufacturer: Yageo; Resistance: 100kR; Power Rating: 125mW; Voltage Rating (DC): 150V; Supplier 1: Digi-Key; Supplier Part Number 1: 311-100KCRCT-ND; Manufacturer Part Number: RC0805FR-07100KL; RoHS: Yes; Category: Chip SMD Resistors; Stock 1: 906733; Pricing 1: 1=0.10000, 10=0.04200, 100=0.01690, 1000=0.00759, 2500=0.00659 (USD); Case/Package: 0805; Number of Pins: 2; Case Code (Metric): 2012; Case Code (Imperial): 0805; Size Code: 0805; Min Operating Temperature: -55°C; Max Operating Temperature: 155°C; Resistor Type: Thick Film; Tolerance: 1%; Temperature Coefficient: 100ppm/°C; Packaging: Tape and Reel; Voltage Rating: 150V; Package Quantity: 1; Number of Terminations: 2; Termination: SMD/SMT; Max Power Dissipation: 125mW; Features: Moisture Resistant; Series: RC; Construction: Rectangular; Resistance Tolerance: 1%; Technology: THICK FILM; Length: 2mm; Width: 0.049inch; Height: 0.024inch; Depth: 1.25mm; Lead Pitch: 0.4mm; REACH SVHC: Unknown; Lead Free: Lead Free; RoHS Compliant: Yes; Military Standard: Not; ComponentLink1URL: https://datasheet.ciiva.com/11808/0900766b8106beab-11808858.pdf?src-supplier=RSComponents; ComponentLink1Description: https://datasheet.ciiva.com/11808/0900766b8106beab-11808858.pdf?src-supplier=RSComponents; ComponentLink2URL: https://datasheet.ciiva.com/7941/1686128-7941677.pdf?src-supplier=Element14; ComponentLink2Description: https://datasheet.ciiva.com/7941/1686128-7941677.pdf?src-supplier=Element14; ComponentLink3URL: https://datasheet.ciiva.com/7660/38627-7660796.pdf?src-supplier=Element14; ComponentLink3Description: https://datasheet.ciiva.com/7660/38627-7660796.pdf?src-supplier=Element14; ComponentLink4URL: https://datasheet.ciiva.com/22747/444164-22747534.pdf?src-supplier=Element14; ComponentLink4Description: https://datasheet.ciiva.com/22747/444164-22747534.pdf?src-supplier=Element14; ComponentLink5URL: https://datasheet.ciiva.com/2457/pyu-r-int-thick-7-2457018.pdf?src-supplier=Digi-Key; ComponentLink5Description: https://datasheet.ciiva.com/2457/pyu-r-int-thick-7-2457018.pdf?src-supplier=Digi-Key; ComponentLink6URL: https://datasheet.ciiva.com/2457/pyu-r-int-thick-7-2457019.pdf?src-supplier=Digi-Key; ComponentLink6Description: https://datasheet.ciiva.com/2457/pyu-r-int-thick-7-2457019.pdf?src-supplier=Digi-Key; ComponentLink7URL: https://datasheet.ciiva.com/2457/pyu-r-int-thick-7-2457017.pdf?src-supplier=Digi-Key; ComponentLink7Description: https://datasheet.ciiva.com/2457/pyu-r-int-thick-7-2457017.pdf?src-supplier=Digi-Key; ComponentLink8URL: https://datasheet.ciiva.com/12667/rc0805-12667001.pdf?src-supplier=Mouser; ComponentLink8Description: https://datasheet.ciiva.com/12667/rc0805-12667001.pdf?src-supplier=Mouser; ComponentLink9URL: https://datasheet.ciiva.com/7941/1697719-7941676.pdf?src-supplier=Element14; ComponentLink9Description: https://datasheet.ciiva.com/7941/1697719-7941676.pdf?src-supplier=Element14; ComponentLink10URL: https://datasheet.ciiva.com/7941/1697719-7941678.pdf?src-supplier=Element14; ComponentLink10Description: https://datasheet.ciiva.com/7941/1697719-7941678.pdf?src-supplier=Element14; ComponentLink11URL: https://datasheet.ciiva.com/16747/rc0805-16747226.pdf?src-supplier=Future+Electronics; ComponentLink11Description: https://datasheet.ciiva.com/16747/rc0805-16747226.pdf?src-supplier=Future+Electronics
R2 R3 R15 R17 R22 = RC0805FR-07560RL: Surface Mount Thick Film Resistor, RC Series, 560 ohm, 125 mW, - 1%, 150 V, 0805 [2012 Metric]; Manufacturer: Yageo; Temperature Coefficient: 100ppm/°C; Power Rating: 125mW; Voltage Rating: 150V; Supplier 1: Digi-Key; Supplier Part Number 1: 311-560CRCT-ND; Manufacturer Part Number: RC0805FR-07560RL; RoHS: Yes; Category: Chip SMD Resistors; Stock 1: 2248; Pricing 1: 1=0.10000, 10=0.04200, 100=0.01690, 1000=0.00759, 2500=0.00659 (USD); Case/Package: 0805; Case Code (Metric): 2012; Case Code (Imperial): 0805; Weight: 0.000194oz; Size Code: 0805; Min Operating Temperature: -55°C; Max Operating Temperature: 155°C; Resistor Type: Thick Film; Tolerance: 1%; Resistance: 560R; Package Quantity: 1; Packaging: Tape and Reel; Number of Terminations: 2; Termination: SMD/SMT; Max Power Dissipation: 125mW; Features: Moisture Resistant; Series: RC; Resistance Tolerance: 1%; Construction: Rectangular; Length: 2mm; Width: 0.049inch; Height: 0.024inch; Depth: 1.25mm; RoHS Compliant: Yes; REACH SVHC: Unknown; Military Standard: Not; Lead Free: Lead Free; ComponentLink1URL: https://datasheet.ciiva.com/2457/pyu-r-int-thick-7-2457141.pdf?src-supplier=Digi-Key; ComponentLink1Description: https://datasheet.ciiva.com/2457/pyu-r-int-thick-7-2457141.pdf?src-supplier=Digi-Key; ComponentLink2URL: https://datasheet.ciiva.com/2457/pyu-r-int-thick-7-2457142.pdf?src-supplier=Digi-Key; ComponentLink2Description: https://datasheet.ciiva.com/2457/pyu-r-int-thick-7-2457142.pdf?src-supplier=Digi-Key; ComponentLink3URL: https://datasheet.ciiva.com/2457/pyu-r-int-thick-7-2457140.pdf?src-supplier=Digi-Key; ComponentLink3Description: https://datasheet.ciiva.com/2457/pyu-r-int-thick-7-2457140.pdf?src-supplier=Digi-Key; ComponentLink4URL: https://datasheet.ciiva.com/5561/rc0805-5561861.pdf?src-supplier=Mouser; ComponentLink4Description: https://datasheet.ciiva.com/5561/rc0805-5561861.pdf?src-supplier=Mouser; ComponentLink5URL: https://datasheet.ciiva.com/7941/444164-7941814.pdf?src-supplier=Element14; ComponentLink5Description: https://datasheet.ciiva.com/7941/444164-7941814.pdf?src-supplier=Element14; ComponentLink6URL: https://datasheet.ciiva.com/7941/444164-7941813.pdf?src-supplier=Element14; ComponentLink6Description: https://datasheet.ciiva.com/7941/444164-7941813.pdf?src-supplier=Element14
R4 R14 R18-R21 = RC0805FR-0710KL: RES SMD 10K OHM 1% 1/8W 0805; Manufacturer: Yageo; Resistance: 10kR; Temperature Coefficient: 100ppm/°C; Power Rating: 125mW; Voltage Rating: 150V; Supplier 1: Digi-Key; Supplier Part Number 1: 311-10.0KCRCT-ND; Manufacturer Part Number: RC0805FR-0710KL; RoHS: Yes; Category: Chip SMD Resistors; Stock 1: 6173104; Pricing 1: 1=0.10000, 10=0.04200, 100=0.01690, 1000=0.00759, 2500=0.00659 (USD); Case/Package: 0805; Case Code (Imperial): 0805; Case Code (Metric): 2012; Size Code: 0805; Min Operating Temperature: -55°C; Max Operating Temperature: 155°C; Tolerance: 1%; Resistor Type: Thick Film; Packaging: Tape and Reel; Package Quantity: 1; Termination: SMD/SMT; Number of Terminations: 2; Max Power Dissipation: 125mW; Features: Moisture Resistant; Series: RC; Construction: Rectangular; Resistance Tolerance: 1%; Technology: THICK FILM; Length: 2mm; Width: 0.049inch; Height: 0.024inch; Depth: 1.25mm; REACH SVHC: Unknown; Military Standard: Not; Lead Free: Lead Free; RoHS Compliant: Yes; ComponentLink1URL: https://datasheet.ciiva.com/11808/0900766b8106beab-11808151.pdf?src-supplier=RSComponents; ComponentLink1Description: https://datasheet.ciiva.com/11808/0900766b8106beab-11808151.pdf?src-supplier=RSComponents; ComponentLink2URL: https://datasheet.ciiva.com/12669/rc0805-12669688.pdf?src-supplier=Mouser; ComponentLink2Description: https://datasheet.ciiva.com/12669/rc0805-12669688.pdf?src-supplier=Mouser; ComponentLink3URL: https://datasheet.ciiva.com/2456/pyu-r-int-thick-7-2456974.pdf?src-supplier=Digi-Key; ComponentLink3Description: https://datasheet.ciiva.com/2456/pyu-r-int-thick-7-2456974.pdf?src-supplier=Digi-Key; ComponentLink4URL: https://datasheet.ciiva.com/2456/pyu-r-int-thick-7-2456972.pdf?src-supplier=Digi-Key; ComponentLink4Description: https://datasheet.ciiva.com/2456/pyu-r-int-thick-7-2456972.pdf?src-supplier=Digi-Key; ComponentLink5URL: https://datasheet.ciiva.com/2456/pyu-r-int-thick-7-2456973.pdf?src-supplier=Digi-Key; ComponentLink5Description: https://datasheet.ciiva.com/2456/pyu-r-int-thick-7-2456973.pdf?src-supplier=Digi-Key; ComponentLink6URL: https://datasheet.ciiva.com/16747/rc0805-16747087.pdf?src-supplier=Future+Electronics; ComponentLink6Description: https://datasheet.ciiva.com/16747/rc0805-16747087.pdf?src-supplier=Future+Electronics; ComponentLink7URL: https://datasheet.ciiva.com/46447/444164-46447563.pdf?src-supplier=Element14; ComponentLink7Description: https://datasheet.ciiva.com/46447/444164-46447563.pdf?src-supplier=Element14
R5-R7 R13 R23-R25 = RC0805FR-0722RL: RES SMD 22 OHM 1% 1/8W 0805; Manufacturer: Yageo; Temperature Coefficient: 100ppm/°C; Power Rating: 125mW; Voltage Rating: 150V; Supplier 1: Digi-Key; Supplier Part Number 1: 311-22.0CRCT-ND; Manufacturer Part Number: RC0805FR-0722RL; RoHS: Yes; Category: Chip SMD Resistors; Stock 1: 361115; Pricing 1: 1=0.10000, 10=0.04200, 100=0.01690, 1000=0.00759, 2500=0.00659 (USD); Case/Package: 0805; Case Code (Metric): 2012; Case Code (Imperial): 0805; Min Operating Temperature: -55°C; Max Operating Temperature: 155°C; Resistor Type: Thick Film; Resistance: 22R; Tolerance: 1%; Packaging: Tape and Reel; Package Quantity: 1; Number of Terminations: 2; Termination: SMD/SMT; Max Power Dissipation: 125mW; Working Voltage: 150V; Features: Moisture Resistant; Series: RC; Resistance Tolerance: 1%; Construction: Rectangular; Technology: THICK FILM; Length: 0.079inch; Width: 0.049inch; Height: 0.024inch; Depth: 1.25mm; RoHS Compliant: Yes; REACH SVHC: Unknown; Military Standard: Not; Lead Free: Lead Free; ComponentLink1URL: https://datasheet.ciiva.com/11819/0900766b8106beab-11819837.pdf?src-supplier=RSComponents; ComponentLink1Description: https://datasheet.ciiva.com/11819/0900766b8106beab-11819837.pdf?src-supplier=RSComponents; ComponentLink2URL: https://datasheet.ciiva.com/46447/444164-46447574.pdf?src-supplier=Element14; ComponentLink2Description: https://datasheet.ciiva.com/46447/444164-46447574.pdf?src-supplier=Element14; ComponentLink3URL: https://datasheet.ciiva.com/2457/pyu-r-int-thick-7-2457045.pdf?src-supplier=Digi-Key; ComponentLink3Description: https://datasheet.ciiva.com/2457/pyu-r-int-thick-7-2457045.pdf?src-supplier=Digi-Key; ComponentLink4URL: https://datasheet.ciiva.com/2457/pyu-r-int-thick-7-2457046.pdf?src-supplier=Digi-Key; ComponentLink4Description: https://datasheet.ciiva.com/2457/pyu-r-int-thick-7-2457046.pdf?src-supplier=Digi-Key; ComponentLink5URL: https://datasheet.ciiva.com/2457/pyu-r-int-thick-7-2457044.pdf?src-supplier=Digi-Key; ComponentLink5Description: https://datasheet.ciiva.com/2457/pyu-r-int-thick-7-2457044.pdf?src-supplier=Digi-Key; ComponentLink6URL: https://datasheet.ciiva.com/12667/rc0805-12667371.pdf?src-supplier=Mouser; ComponentLink6Description: https://datasheet.ciiva.com/12667/rc0805-12667371.pdf?src-supplier=Mouser
R8 R26-R28 = CR0805AJ/-000EAS: Res Anti-Sulfured Jumper Thick Film 0805 0 Ohm 1/8W Molded Paper T/R; Manufacturer: Bourns; Supplier 1: Digi-Key; Supplier Part Number 1: CR0805AJ/-000EASCT-ND; Manufacturer Part Number: CR0805AJ/-000EAS; RoHS: Yes; Category: Chip SMD Resistors; Stock 1: 9970; Pricing 1: 1=0.10000, 10=0.06700, 100=0.02710, 1000=0.01219, 2500=0.01058 (USD)
R9 R16 = RC0805FR-071ML: RES SMD 1M OHM 1% 1/8W 0805; Manufacturer: Yageo; Resistance: 1MR; Power Rating: 125mW; Temperature Coefficient: 100ppm/°C; Voltage Rating: 150V; Supplier 1: Digi-Key; Supplier Part Number 1: 311-1.00MCRCT-ND; Manufacturer Part Number: RC0805FR-071ML; RoHS: Yes; Category: Chip SMD Resistors; Stock 1: 862451; Pricing 1: 1=0.10000, 10=0.04200, 100=0.01690, 1000=0.00759, 2500=0.00659 (USD); Case/Package: 0805; Case Code (Metric): 2012; Case Code (Imperial): 0805; Size Code: 0805; Min Operating Temperature: -55°C; Max Operating Temperature: 155°C; Tolerance: 1%; Packaging: Tape and Reel; Package Quantity: 1; Resistor Type: Thick Film; Number of Terminations: 2; Termination: SMD/SMT; Max Power Dissipation: 125mW; Features: Moisture Resistant; Series: RC; Construction: Rectangular; Resistance Tolerance: 1%; Length: 0.079inch; Width: 0.049inch; Height: 0.024inch; Depth: 1.25mm; REACH SVHC: Unknown; Lead Free: Lead Free; Military Standard: Not; RoHS Compliant: Yes; ComponentLink1URL: https://datasheet.ciiva.com/12666/rc0805-12666975.pdf?src-supplier=Mouser; ComponentLink1Description: https://datasheet.ciiva.com/12666/rc0805-12666975.pdf?src-supplier=Mouser; ComponentLink2URL: https://datasheet.ciiva.com/2519/pyu-r-int-thick-7-2519711.pdf?src-supplier=Digi-Key; ComponentLink2Description: https://datasheet.ciiva.com/2519/pyu-r-int-thick-7-2519711.pdf?src-supplier=Digi-Key; ComponentLink3URL: https://datasheet.ciiva.com/2519/pyu-r-int-thick-7-2519712.pdf?src-supplier=Digi-Key; ComponentLink3Description: https://datasheet.ciiva.com/2519/pyu-r-int-thick-7-2519712.pdf?src-supplier=Digi-Key; ComponentLink4URL: https://datasheet.ciiva.com/2519/pyu-r-int-thick-7-2519713.pdf?src-supplier=Digi-Key; ComponentLink4Description: https://datasheet.ciiva.com/2519/pyu-r-int-thick-7-2519713.pdf?src-supplier=Digi-Key; ComponentLink5URL: https://datasheet.ciiva.com/17419/rc0805-17419909.pdf?src-supplier=Future+Electronics; ComponentLink5Description: https://datasheet.ciiva.com/17419/rc0805-17419909.pdf?src-supplier=Future+Electronics